# Altium schematic sheet UPS.SchDoc: UPS
size A4; SheetNumber: 8
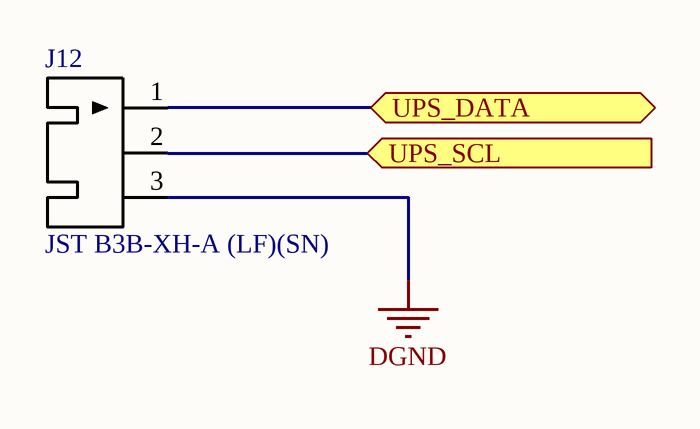
[diagram p0: UPS.SchDoc]

## Parts
J12  JST B3B-XH-A (LF)(SN)  [PCB-sw29re0t3wmdwksqqhzo-1]

## Ports
UPS_DATA (bidir), UPS_SCL (in)

## Nets
DGND: J12.3
UPS_DATA: J12.1 ; port UPS_DATA
UPS_SCL: J12.2 ; port UPS_SCL

## Notes on the sheet
- Title
- Size:
- Date:
- A3
- Author:
- Time:
- Revision:
- Sheet
- of
- File:

## Library data of the parts
J12 = CMP-56379f4f046d89f0-13: XH Series 3 Position 2.5 mm Pitch Through Hole Crimp Top Entry Shrouded Header